# EAGLE design Controller_Board (EAGLE 8.4.2)
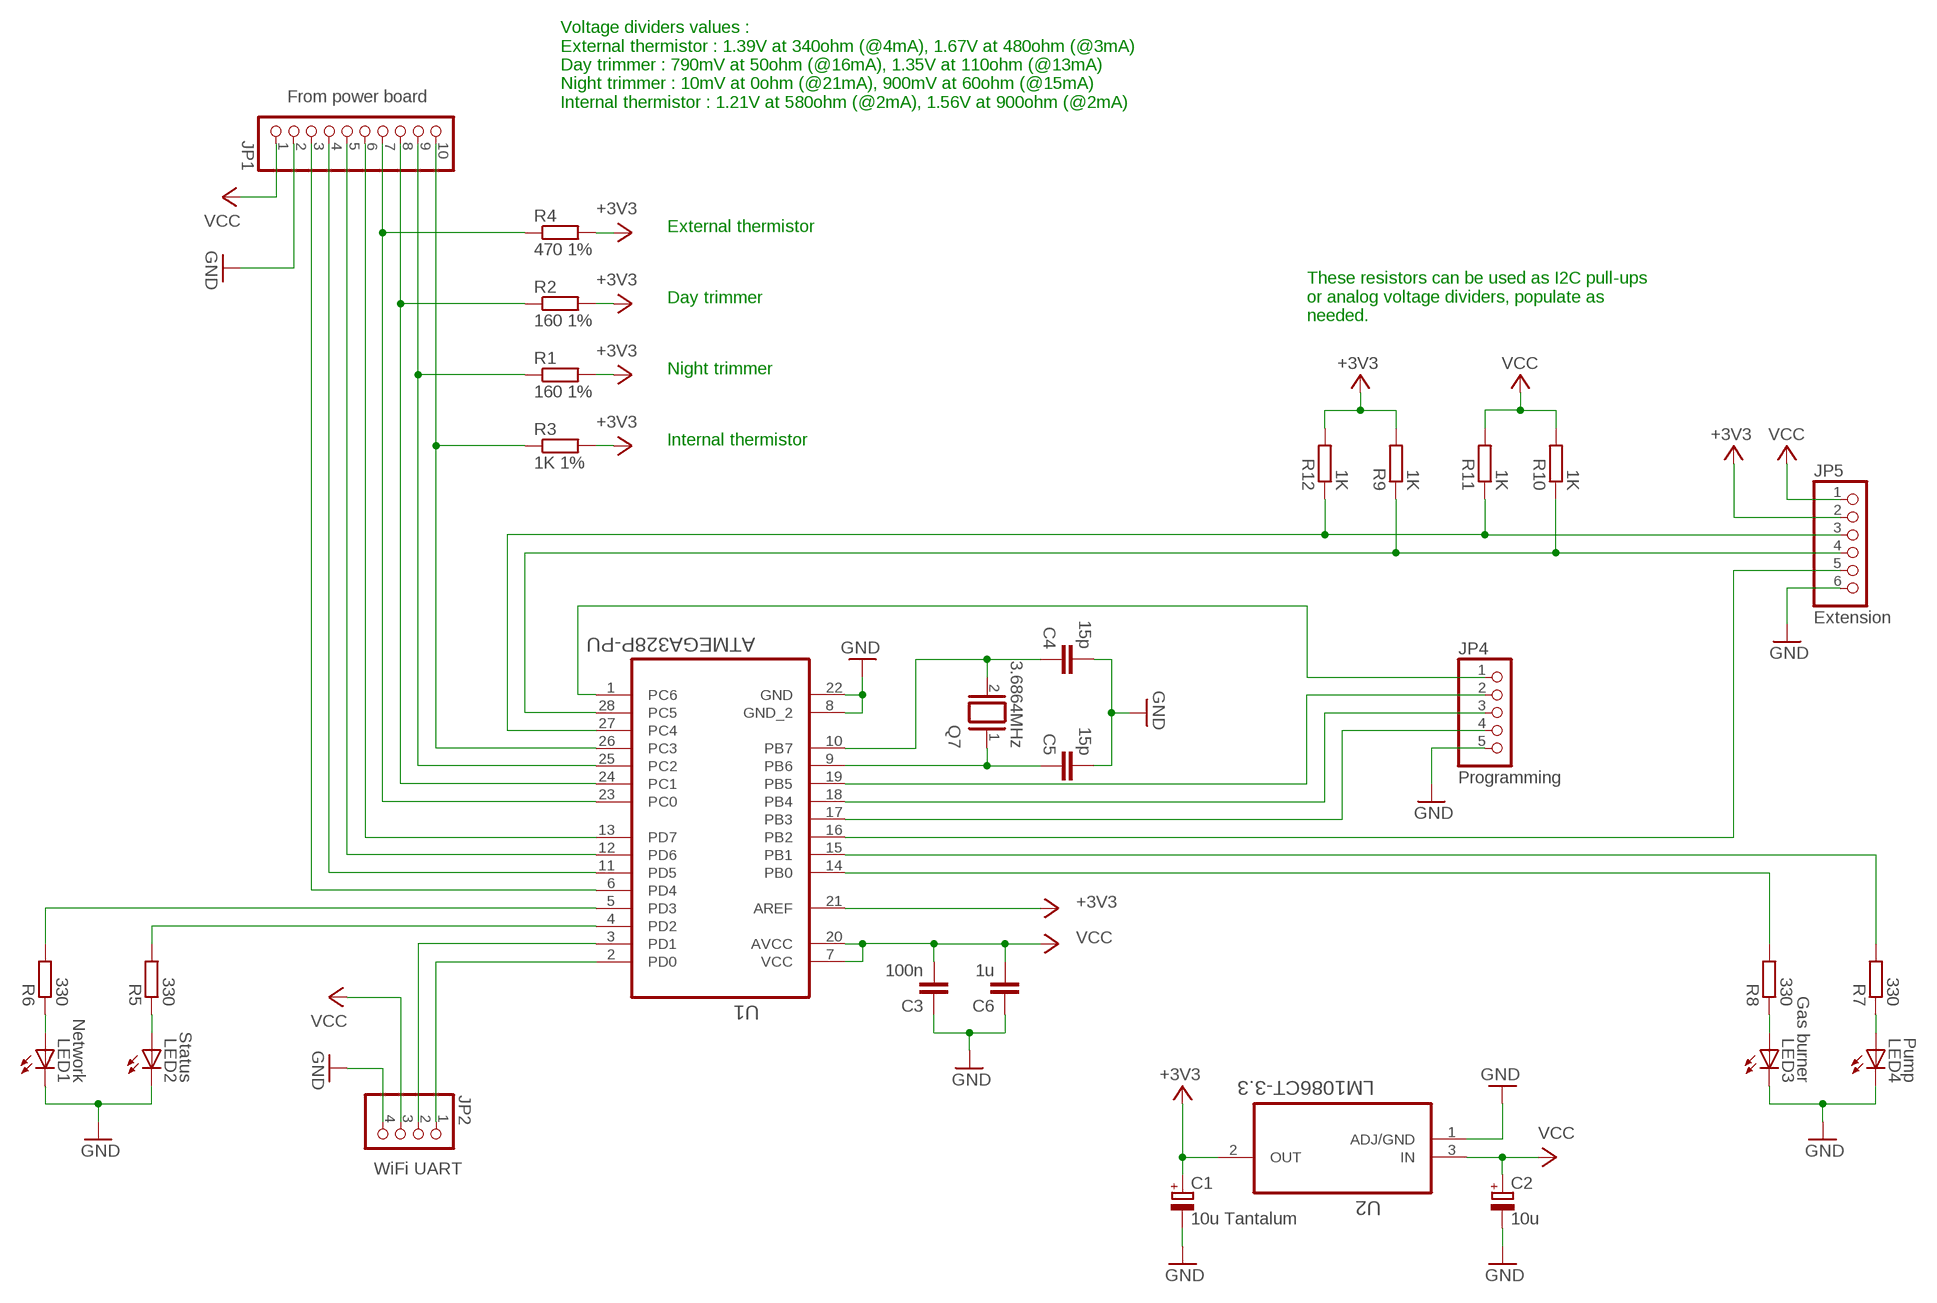
[diagram p0: schematic, sheet 1]

## Parts
C1  10u Tantalum  CPOL-EUE2.5-7  [E2,5-7]
C2  10u  CPOL-EUE2.5-7  [E2,5-7]
C3  100n  C-EU050-035X075  [C050-035X075]
C4  15p  C-EU025-050X050  [C025-050X050]
C5  15p  C-EU025-050X050  [C025-050X050]
C6  1u  C-EU050-035X075  [C050-035X075]
JP1  From power board  PINHD-1X10  [1X10]
JP2  WiFi UART  PINHD-1X4  [1X04]
JP4  Programming  PINHD-1X5  [1X05]
JP5  Extension  PINHD-1X6  [1X06]
LED1  Network  LED5MM  [LED5MM]
LED2  Status  LED5MM  [LED5MM]
LED3  Gas burner  LED5MM  [LED5MM]
LED4  Pump  LED5MM  [LED5MM]
Q7  3.6864MHz  XTAL/S  [QS]
R1  160 1%  R-EU_0207/10  [0207/10]
R2  160 1%  R-EU_0207/10  [0207/10]
R3  1K 1%  R-EU_0207/10  [0207/10]
R4  470 1%  R-EU_0207/10  [0207/10]
R5  330  R-EU_0207/10  [0207/10]
R6  330  R-EU_0207/10  [0207/10]
R7  330  R-EU_0207/10  [0207/10]
R8  330  R-EU_0207/10  [0207/10]
R9  1K  R-EU_0207/10  [0207/10]
R10  1K  R-EU_0207/10  [0207/10]
R11  1K  R-EU_0207/10  [0207/10]
R12  1K  R-EU_0207/10  [0207/10]
U1  ATMEGA328P-PU  [DIP254P762X457-28]
U2  LM1086CT-3.3  [TO254P470X1016X2222-3P]

## Nets
+3V3: C1.+ JP5.2 R1.2 R2.2 R3.2 R4.2 R9.2 R12.2 U1.21(AREF) U2.2(OUT)
GND: C1.- C2.- C3.1 C4.2 C5.2 C6.1 JP1.2 JP2.4 JP4.5 JP5.6 LED1.K(C) LED2.K(C) LED3.K(C) LED4.K(C) U1.8(GND_2) U1.22(GND) U2.1(ADJ/GND)
N$1: JP1.10 R3.1 U1.26(PC3)
N$2: JP1.9 R1.1 U1.25(PC2)
N$3: JP1.8 R2.1 U1.24(PC1)
N$4: JP1.7 R4.1 U1.23(PC0)
N$5: JP1.6 U1.13(PD7)
N$6: JP1.5 U1.12(PD6)
N$7: JP1.4 U1.11(PD5)
N$8: JP1.3 U1.6(PD4)
N$9: JP2.2 U1.3(PD1)
N$10: JP2.1 U1.2(PD0)
N$11: LED1.A R6.1
N$12: LED2.A R5.1
N$13: R6.2 U1.5(PD3)
N$14: R5.2 U1.4(PD2)
N$15: JP4.2 U1.19(PB5)
N$17: JP4.3 U1.18(PB4)
N$18: JP4.4 U1.17(PB3)
N$19: JP4.1 U1.1(PC6)
N$20: JP5.3 R11.1 R12.1 U1.27(PC4)
N$21: LED4.A R7.1
N$22: LED3.A R8.1
N$23: JP5.4 R9.1 R10.1 U1.28(PC5)
N$24: R8.2 U1.14(PB0)
N$25: R7.2 U1.15(PB1)
N$26: JP5.5 U1.16(PB2)
N$27: C4.1 Q7.2 U1.10(PB7)
N$29: C5.1 Q7.1 U1.9(PB6)
VCC: C2.+ C3.2 C6.2 JP1.1 JP2.3 JP5.1 R10.2 R11.2 U1.7(VCC) U1.20(AVCC) U2.3(IN)

## Notes on the sheet
- Voltage dividers values :
  External thermistor : 1.39V at 340ohm (@4mA), 1.67V at 480ohm (@3mA)
  Day trimmer : 790mV at 50ohm (@16mA), 1.35V at 110ohm (@13mA)
  Night trimmer : 10mV at 0ohm (@21mA), 900mV at 60ohm (@15mA)
  Internal thermistor : 1.21V at 580ohm (@2mA), 1.56V at 900ohm (@2mA)
- External thermistor
- Day trimmer
- These resistors can be used as I2C pull-ups 
  or analog voltage dividers, populate as
  needed.
- Night trimmer
- Internal thermistor

## Library data of the parts
C1 C2 = rcl:CPOL-EU: POLARIZED CAPACITOR, European symbol
C3-C6 = rcl:C-EU: CAPACITOR, European symbol
JP1 = pinhead:PINHD-1X10: PIN HEADER
JP2 = pinhead:PINHD-1X4: PIN HEADER
JP4 = pinhead:PINHD-1X5: PIN HEADER
JP5 = pinhead:PINHD-1X6: PIN HEADER
LED1-LED4 = led:LED: LED OSRAM: - CHIPLED LG R971, LG N971, LY N971, LG Q971, LY Q971, LO R971, LY R971 LH N974, LH R974 LS Q976, LO Q976, LY Q976 LO Q996 - Hyper CHIPLED LW Q18S LB Q993, LB Q99A, LB R99A - SideLED LS A670, LO A670, LY A670, LG A670, LP A670 LB A673, LV A673, LT A673, LW A673 LH A674 LY A675 LS A676, LA A676, LO A676, LY A676, LW A676 LS A679, LY A679, LG A679 - Hyper Micro SIDELED® LS Y876, LA Y876, LO Y876, LY Y876 LT Y87S - SmartLED LW L88C, LW L88S LB L89C, LB L89S, LG L890 LS L89K, LO L89K, LY L89K LS L896, LA L896, LO L896, LY L896 - TOPLED LS T670, LO T670, LY T670, LG T670, LP T670 LSG T670, LSP T670, LSY T670, LOP T670, LYG T670 LG T671, LOG T671, LSG T671 LB T673, LV T673, LT T673, LW T673 LH T674 LS T676, LA T676, LO T676, LY T676, LB T676, LH T676, LSB T676, LW T676 LB T67C, LV T67C, LT T67C, LS T67K, LO T67K, LY T67K, LW E67C LS E67B, LA E67B, LO E67B, LY E67B, LB E67C, LV E67C, LT E67C LW T67C LS T679, LY T679, LG T679 LS T770, LO T770, LY T770, LG T770, LP T770 LB T773, LV T773, LT T773, LW T773 LH T774 LS E675, LA E675, LY E675, LS T675 LS T776, LA T776, LO T776, LY T776, LB T776 LHGB T686 LT T68C, LB T68C - Hyper Mini TOPLED® LB M676 - Mini TOPLED Santana® LG M470 LS M47K, LO M47K, LY M47K Source: http://www.osram.convergy.de LUXEON: - LUMILED® LXK2-PW12-R00, LXK2-PW12-S00, LXK2-PW14-U00, LXK2-PW14-V00 LXK2-PM12-R00, LXK2-PM12-S00, LXK2-PM14-U00 LXK2-PE12-Q00, LXK2-PE12-R00, LXK2-PE12-S00, LXK2-PE14-T00, LXK2-PE14-U00 LXK2-PB12-K00, LXK2-PB12-L00, LXK2-PB12-M00, LXK2-PB14-N00, LXK2-PB14-P00, LXK2-PB14-Q00 LXK2-PR12-L00, LXK2-PR12-M00, LXK2-PR14-Q00, LXK2-PR14-R00 LXK2-PD12-Q00, LXK2-PD12-R00, LXK2-PD12-S00 LXK2-PH12-R00, LXK2-PH12-S00 LXK2-PL12-P00, LXK2-PL12-Q00, LXK2-PL12-R00 Source: www.luxeon.com KINGBRIGHT: KA-3528ASYC Source: www.kingbright.com
Q7 = special:XTAL/S: CRYSTAL
R1-R12 = resistor:R-EU_: RESISTOR, European symbol
U1 = ATMEGA328P-PU:ATMEGA328P-PU: 8-bit Microcontroller with In-System Programmable Flash; MPN: ATMEGA328P-PU; OC_FARNELL: 1715487; OC_NEWARK: 68T2944; PACKAGE: PDIP-28; SUPPLIER: Atmel
U2 = LM1086CT-3.3:LM1086CT-3.3: IC, LDO VOLT REG, 3.3V, 1.5A; MPN: LM1086CT-3.3; OC_FARNELL: 9489983; OC_NEWARK: 41K3395; PACKAGE: TO-220; SUPPLIER: NATIONAL SEMICONDUCTOR

## Board
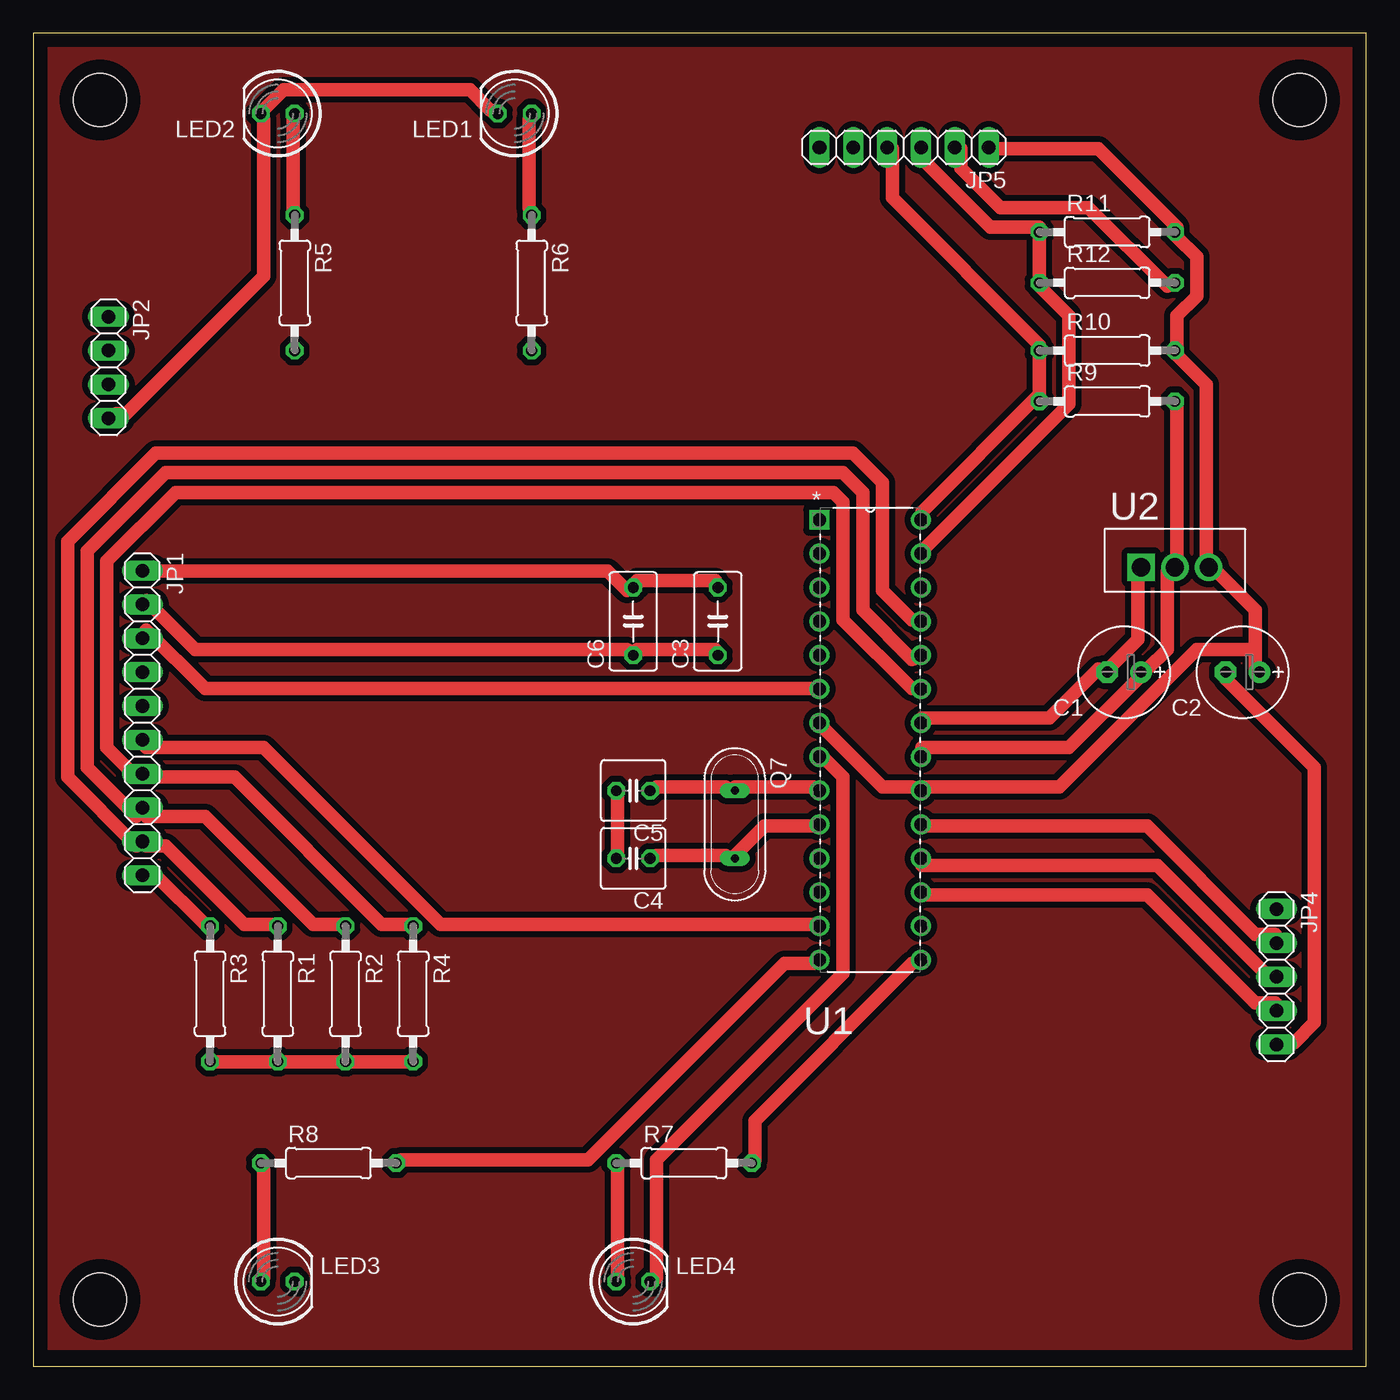
[diagram p1: board, top side]
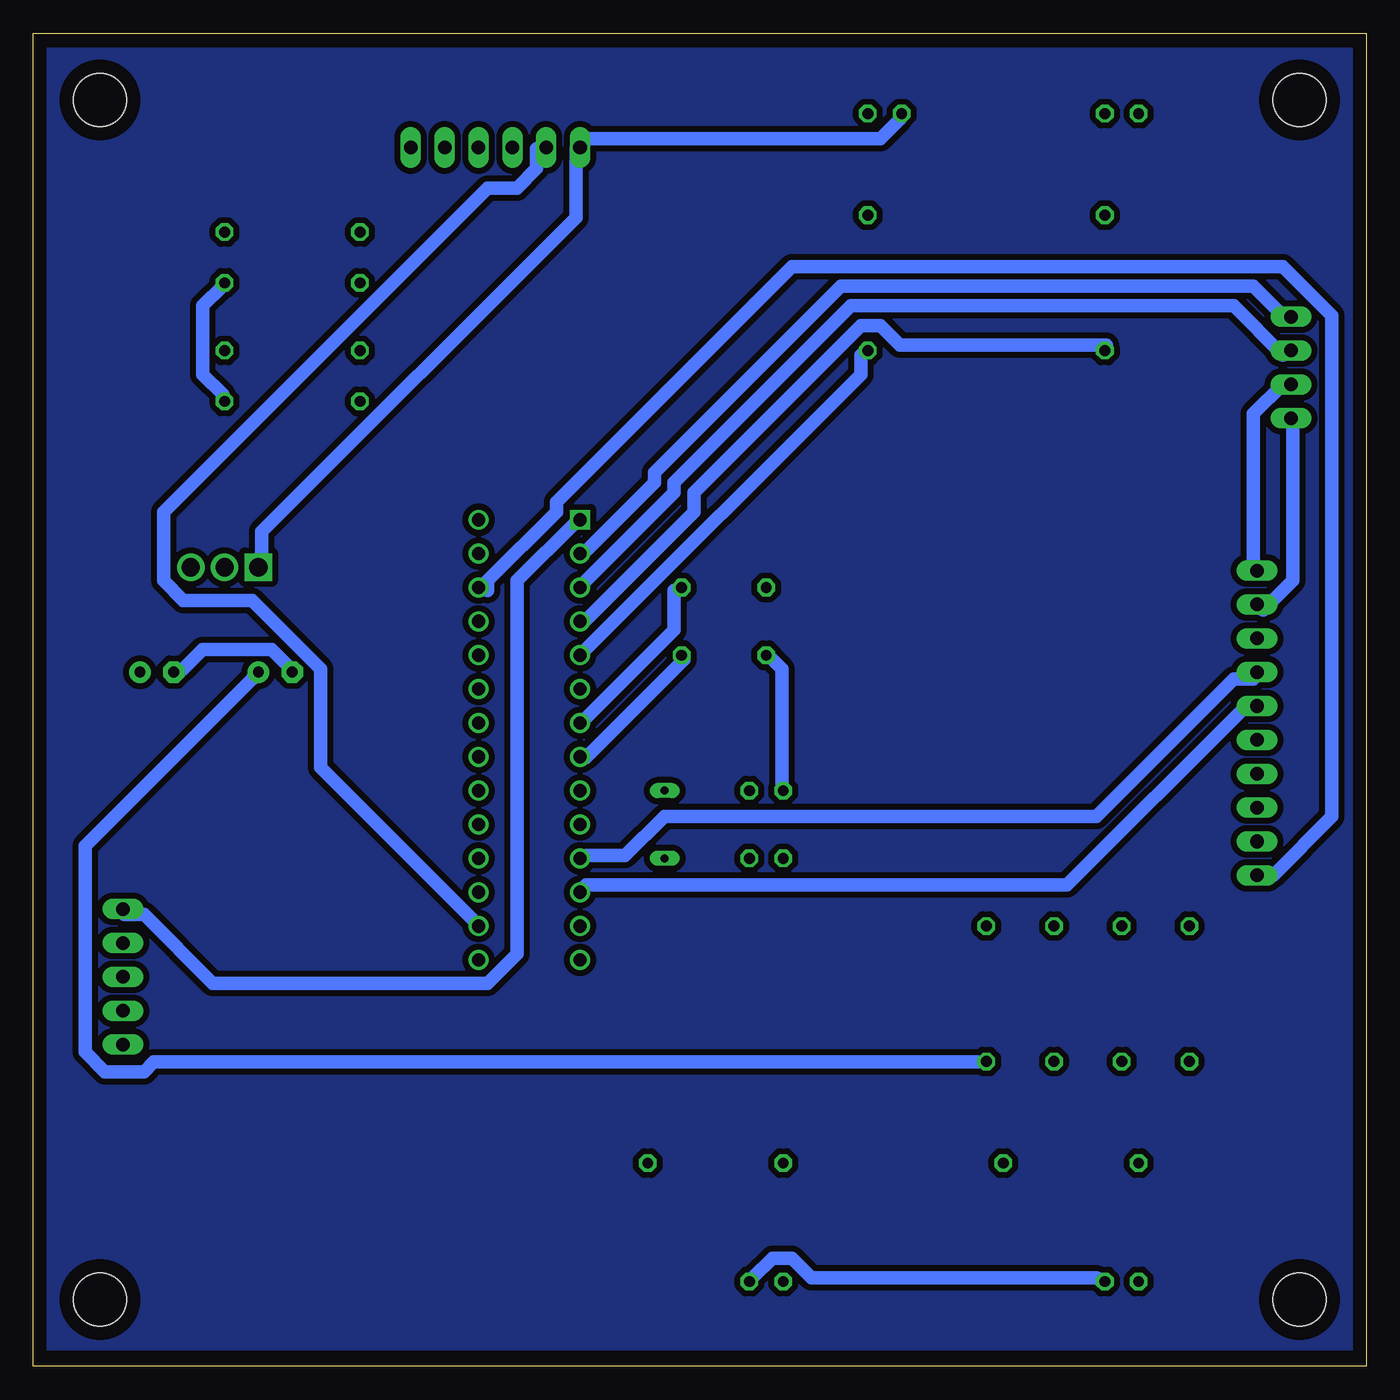
[diagram p2: board, bottom side, seen from below]

Size 100 x 100 mm. Coordinates in mm from the lower left corner, seen from the top.
Outline: 0,0 100,0 100,100 0,100 0,0
Copper layers (1*16): Top 0.035mm / dielectric 1.5mm / Bottom 0.035mm
Design rules "default *": minimum track width 40mil, minimum drill 0.35mm, track to track 18mil, track to pad 14mil, pad to pad 6mil, via to via 6mil, smd to smd 6mil, copper to edge 40mil, drill to drill 6mil, minimum pad ring 10mil, minimum via ring 8mil, stop-mask expansion 4mil, vias tented up to drill 0mil, thermal gap 10mil
Holes 4 mm at 5,5 95,5 95,95 5,95

### Footprints (pad centres in the part's own frame; a part is rotated, then mirrored left to right if it is on the bottom)
E2,5-7 = drill 0.813 pad 1.6: + -1.27,0 | drill 0.813 pad 1.6 octagon: - 1.27,0
C050-035X075 = drill 0.813 octagon: 1 -2.54,0; 2 2.54,0
C025-050X050 = drill 0.813 octagon: 1 -1.27,0; 2 1.27,0
1X10 = drill 1.016 long: 1 -11.43,0; 2 -8.89,0; 3 -6.35,0; 4 -3.81,0; 5 -1.27,0; 6 1.27,0; 7 3.81,0; 8 6.35,0; 9 8.89,0; 10 11.43,0
1X04 = drill 1.016 long: 1 -3.81,0; 2 -1.27,0; 3 1.27,0; 4 3.81,0
1X05 = drill 1.016 long: 1 -5.08,0; 2 -2.54,0; 3 0,0; 4 2.54,0; 5 5.08,0
1X06 = drill 1.016 long: 1 -6.35,0; 2 -3.81,0; 3 -1.27,0; 4 1.27,0; 5 3.81,0; 6 6.35,0
LED5MM = drill 0.813 octagon: A -1.27,0; K 1.27,0
QS = drill 0.61 long: 1 -2.54,0; 2 2.54,0
0207/10 = drill 0.813 octagon: 1 -5.08,0; 2 5.08,0
DIP254P762X457-28 = drill 0.991 square: 1 -7.62,33.02 | drill 0.991: 2 -7.62,30.48; 3 -7.62,27.94; 4 -7.62,25.4; 5 -7.62,22.86; 6 -7.62,20.32; 7 -7.62,17.78; 8 -7.62,15.24; 9 -7.62,12.7; 10 -7.62,10.16; 11 -7.62,7.62; 12 -7.62,5.08; 13 -7.62,2.54; 14 -7.62,0; 15 0,0; 16 0,2.54; 17 0,5.08; 18 0,7.62; 19 0,10.16; 20 0,12.7; 21 0,15.24; 22 0,17.78; 23 0,20.32; 24 0,22.86; 25 0,25.4; 26 0,27.94; 27 0,30.48; 28 0,33.02
TO254P470X1016X2222-3P = drill 1.372 square: 1 -5.08,-1.016 | drill 1.372: 2 -2.54,-1.016; 3 0,-1.016

### Placement (x,y rotation side)
C1  81.84,52.07 180 top
C2  90.73,52.07 180 top
C3  51.36,55.88 90 top
C4  45.01,38.1 180 top
C5  45.01,43.18 180 top
C6  45.01,55.88 90 top
JP1  8.18,48.26 270 top
JP2  5.64,74.93 270 top
JP4  93.27,29.21 270 top
JP5  65.33,91.44 180 top
LED1  36.12,93.98 180 top
LED2  18.34,93.98 180 top
LED3  18.34,6.35 0 top
LED4  45.01,6.35 0 top
Q7  52.63,40.64 270 top
R1  18.34,27.94 270 top
R2  23.42,27.94 270 top
R3  13.26,27.94 270 top
R4  28.5,27.94 270 top
R5  19.61,81.28 270 top
R6  37.39,81.28 270 top
R7  48.82,15.24 0 top
R8  22.15,15.24 0 top
R9  80.57,72.39 0 top
R10  80.57,76.2 0 top
R11  80.57,85.09 0 top
R12  80.57,81.28 0 top
U1  66.6,30.48 0 top
U2  88.19,60.96 0 top

### Tracks (layer width: path | path; a pad name or v marks a point on that pad's centre or on a via)
+3V3
  Top 1.016: JP5.2 69.6,91.34 69.6,89.86 72.54,86.92 79.17,86.92 85.07,81.03 R12.2 | R3.2 13.62,22.84 18.03,22.84 R1.2 18.77,22.84 23.19,22.84 R2.2 23.93,22.84 28.35,22.84 R4.2 | U1.21 66.65,46.41 77.7,46.41 82.86,51.56 C1.+ 83.59,52.3 85.07,53.77 85.07,59.66 U2.2 85.8,60.4 85.8,72.19 R9.2
  Bottom 1.016: R9.2 85.8,72.92 87.28,74.4 87.28,79.55 85.8,81.03 R12.2 | R4.2 29.08,22.84 90.96,22.84 91.69,22.1 94.64,22.1 96.12,23.57 96.12,39.04 83.59,51.56 C1.+
GND
  Top 1.016: C4.2 43.82,38.3 43.82,42.72 C5.2 | C3.1 51.18,53.77 45.29,53.77 C6.1 44.55,53.77 12.14,53.77 8.46,57.45 JP1.2 | LED4.K 46.76,6.63 46.76,15.47 60.76,29.46 60.76,44.2 59.28,45.67 U1.8 | U1.22 66.65,48.62 76.23,48.62 79.91,52.3 C1.- 80.65,52.3 82.86,54.51 82.86,59.66 U2.1 | JP4.5 93.91,24.31 94.64,24.31 96.12,25.78 96.12,44.93 89.48,51.56 C2.- | LED1.K 34.24,94.28 32.77,95.76 18.77,95.76 17.3,94.28 LED2.K 17.3,93.55 17.3,81.76 6.99,71.45 6.25,71.45 JP2.4
  Bottom 1.016: LED3.K 20.24,6.63 41.61,6.63 43.08,8.1 44.55,8.1 46.03,6.63 LED4.K | U1.8 58.55,45.67 51.18,53.03 C3.1 | C5.2 43.82,43.46 43.82,52.3 44.55,53.03 C6.1 | C1.- 80.65,52.3 82.12,53.77 87.28,53.77 88.75,52.3 C2.- | JP2.4 5.51,70.71 5.51,58.93 7.72,56.72 JP1.2 | LED1.K 34.98,93.55 36.45,92.08 58.55,92.08 JP5.6 59.28,91.34 59.28,86.18 82.86,62.61 82.86,60.4 U2.1
N$1
  Top 1.016: JP1.10 9.2,36.83 12.88,33.15 R3.1
  Bottom 1.016: JP1.10 6.99,36.83 2.57,41.25 2.57,78.82 6.25,82.5 43.08,82.5 60.76,64.82 60.76,64.08 65.91,58.93 65.91,58.19 U1.26
N$2
  Top 1.016: R1.1 18.03,33.15 15.83,33.15 9.93,39.04 8.46,39.04 JP1.9 7.72,39.04 2.57,44.2 2.57,61.87 9.2,68.5 61.5,68.5 63.7,66.29 63.7,58.19 65.91,55.98 U1.25
N$3
  Top 1.016: R2.1 23.19,33.15 20.98,33.15 12.88,41.25 8.46,41.25 JP1.8 7.72,41.25 4.04,44.93 4.04,61.14 9.93,67.03 60.76,67.03 62.23,65.56 62.23,56.72 65.91,53.03 U1.24
N$4
  Top 1.016: R4.1 28.35,33.15 26.14,33.15 15.09,44.2 8.46,44.2 JP1.7 7.72,44.2 5.51,46.41 5.51,60.4 10.67,65.56 60.02,65.56 60.76,64.82 60.76,55.98 65.91,50.83 U1.23
N$5
  Top 1.016: U1.13 58.55,33.15 30.56,33.15 17.3,46.41 8.46,46.41 JP1.6
N$6
  Bottom 1.016: U1.12 58.55,36.09 22.45,36.09 9.2,49.35 8.46,49.35 JP1.5
N$7
  Bottom 1.016: U1.11 58.55,38.3 55.6,38.3 52.66,41.25 20.24,41.25 9.93,51.56 8.46,51.56 JP1.4
N$8
  Top 1.016: U1.6 58.55,50.83 12.88,50.83 8.46,55.24 JP1.3
N$9
  Bottom 1.016: U1.3 58.55,58.93 51.92,65.56 51.92,66.29 38.66,79.55 9.93,79.55 6.25,75.87 JP2.2
N$10
  Bottom 1.016: U1.2 58.55,61.14 53.39,66.29 53.39,67.03 39.4,81.03 8.46,81.03 6.25,78.82 JP2.1
N$11
  Top 1.016: R6.1 37.19,86.92 37.19,93.55 LED1.A
N$12
  Top 1.016: R5.1 19.51,86.92 19.51,93.55 LED2.A
N$13
  Bottom 1.016: U1.5 37.92,74.4 37.92,75.87 R6.2
N$14
  Bottom 1.016: R5.2 19.51,76.61 34.98,76.61 36.45,78.08 37.92,78.08 50.45,65.56 50.45,64.08 58.55,55.98 U1.4
N$15
  Top 1.016: U1.19 66.65,40.51 83.59,40.51 91.69,32.41 93.17,32.41 JP4.2
N$16
  pour Bottom: 0.56,99.06 99.62,99.06 99.62,1.27 0.56,1.27
N$17
  Top 1.016: U1.18 66.65,37.57 84.33,37.57 92.43,29.46 93.17,29.46 JP4.3
N$18
  Top 1.016: U1.17 66.65,35.36 83.59,35.36 91.69,27.25 93.17,27.25 JP4.4
N$19
  Bottom 1.016: U1.1 59.28,63.35 63.7,58.93 63.7,30.94 65.91,28.73 86.54,28.73 91.69,33.88 93.17,33.88 JP4.1
N$20
  Top 1.016: U1.27 66.65,61.14 77.7,72.19 77.7,78.82 75.49,81.03 R12.1 R11.1 75.49,85.45 71.81,85.45 66.65,90.6 66.65,91.34 JP5.3
N$21
  Top 1.016: LED4.A 43.82,6.63 43.82,14.73 R7.1
N$22
  Top 1.016: LED3.A 17.3,6.63 17.3,14.73 R8.1
N$23
  Top 1.016: 75.49,72.92 R10.1 75.49,76.61 64.44,87.66 64.44,91.34 JP5.4 | 75.49,72.92 66.65,64.08 U1.28 | 75.49,72.92 R9.1
N$24
  Top 1.016: R8.2 27.61,15.47 41.61,15.47 56.34,30.2 58.55,30.2 U1.14
N$25
  Top 1.016: R7.2 54.13,15.47 54.13,18.41 65.91,30.2 U1.15
N$26
  Bottom 1.016: U1.16 66.65,33.15 78.44,44.93 78.44,52.3 83.59,57.45 88.75,57.45 90.22,58.93 90.22,64.08 65.91,88.39 63.7,88.39 62.23,89.86 62.23,91.34 JP5.5
N$27
  Top 1.016: C4.1 46.76,38.3 51.92,38.3 Q7.2 52.66,38.3 54.86,40.51 58.55,40.51 U1.10
N$28
  pour Top: 0.56,99.06 99.62,99.06 99.62,1.27 0.56,1.27
N$29
  Top 1.016: C5.1 46.76,43.46 51.92,43.46 Q7.1 52.66,43.46 58.55,43.46 U1.9
VCC
  Top 1.016: 91.69,53.77 91.69,56.72 88.75,59.66 U2.3 88.01,60.4 88.01,73.66 85.8,75.87 R10.2 85.8,76.61 85.8,78.82 87.28,80.29 87.28,83.24 85.8,84.71 R11.2 85.8,85.45 79.91,91.34 71.81,91.34 JP5.1 | 91.69,53.77 91.69,52.3 C2.+ | C3.2 51.18,58.93 45.29,58.93 C6.2 44.55,58.19 43.08,59.66 8.46,59.66 JP1.1 | U1.7 59.28,47.88 63.7,43.46 65.91,43.46 U1.20 66.65,43.46 76.96,43.46 87.28,53.77 91.69,53.77
  Bottom 1.016: JP2.3 6.25,73.66 8.46,71.45 8.46,60.4 JP1.1 | C3.2 51.92,58.19 51.92,55.24 58.55,48.62 U1.7